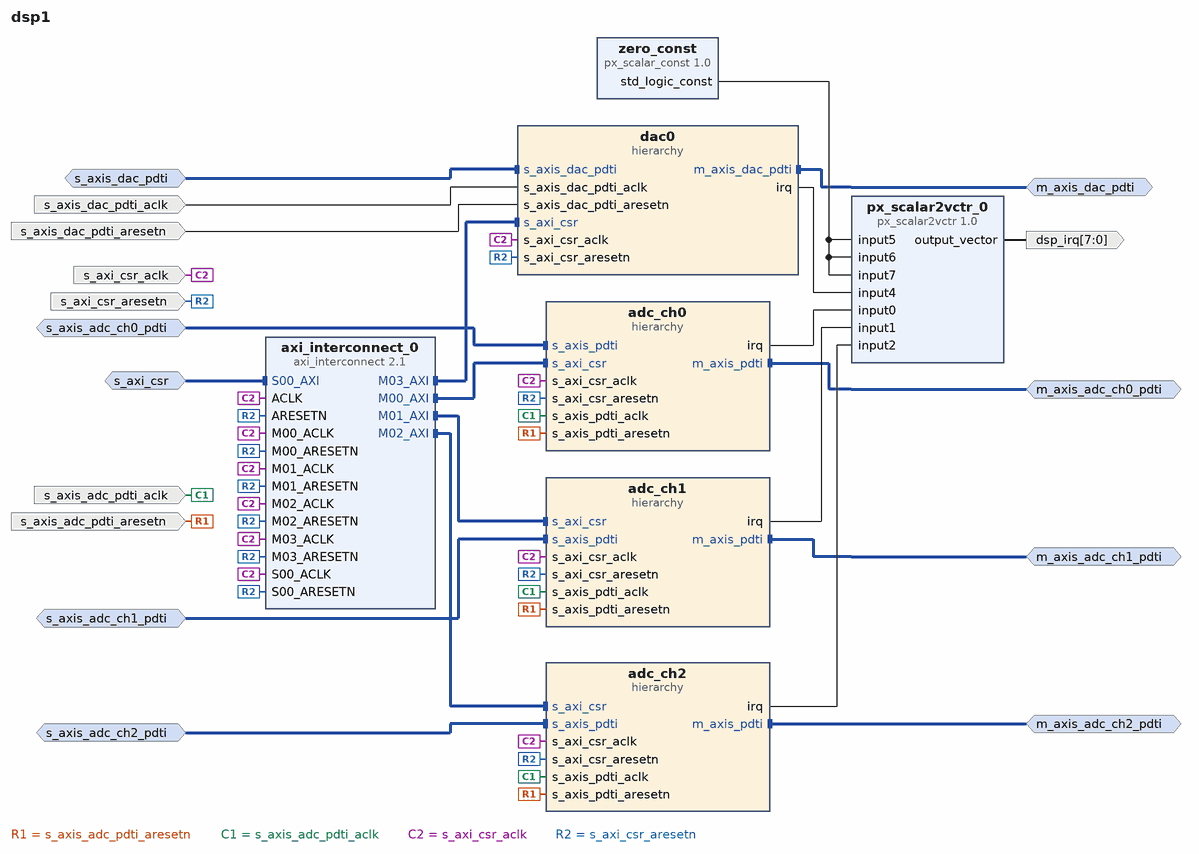
[diagram p0: block diagram of the top level]
# Vivado block design dsp1, xcku060-ffva1156-2-e, Vivado 2017.2
create_bd_design dsp1

create_bd_intf_port -mode Slave -vlnv xilinx.com:interface:aximm_rtl:1.0 s_axi_csr
set_property -dict [list \
  CONFIG.DATA_WIDTH 32 \
  CONFIG.PROTOCOL AXI4LITE \
  CONFIG.FREQ_HZ 250000000 \
  CONFIG.ID_WIDTH 0 \
  CONFIG.ADDR_WIDTH 26 \
  CONFIG.AWUSER_WIDTH 0 \
  CONFIG.ARUSER_WIDTH 0 \
  CONFIG.WUSER_WIDTH 0 \
  CONFIG.RUSER_WIDTH 0 \
  CONFIG.BUSER_WIDTH 0 \
  CONFIG.READ_WRITE_MODE READ_WRITE \
  CONFIG.HAS_BURST 1 \
  CONFIG.HAS_LOCK 1 \
  CONFIG.HAS_PROT 1 \
  CONFIG.HAS_CACHE 1 \
  CONFIG.HAS_QOS 1 \
  CONFIG.HAS_REGION 1 \
  CONFIG.HAS_WSTRB 1 \
  CONFIG.HAS_BRESP 1 \
  CONFIG.HAS_RRESP 1 \
  CONFIG.SUPPORTS_NARROW_BURST 0 \
  CONFIG.NUM_READ_OUTSTANDING 1 \
  CONFIG.NUM_WRITE_OUTSTANDING 1 \
  CONFIG.MAX_BURST_LENGTH 1 \
  CONFIG.CLK_DOMAIN dsp_s_axi_csr_aclk \
  CONFIG.NUM_READ_THREADS 1 \
  CONFIG.NUM_WRITE_THREADS 1 \
  CONFIG.RUSER_BITS_PER_BYTE 0 \
  CONFIG.WUSER_BITS_PER_BYTE 0 \
] [get_bd_intf_ports s_axi_csr]
create_bd_intf_port -mode Slave -vlnv xilinx.com:interface:axis_rtl:1.0 s_axis_adc_ch0_pdti
set_property -dict [list \
  CONFIG.TDATA_NUM_BYTES 2 \
  CONFIG.TDEST_WIDTH 0 \
  CONFIG.TID_WIDTH 0 \
  CONFIG.TUSER_WIDTH 128 \
  CONFIG.HAS_TREADY 0 \
  CONFIG.HAS_TSTRB 0 \
  CONFIG.HAS_TKEEP 0 \
  CONFIG.HAS_TLAST 0 \
  CONFIG.CLK_DOMAIN dsp_s_axis_pdti_aclk \
  CONFIG.LAYERED_METADATA undef \
] [get_bd_intf_ports s_axis_adc_ch0_pdti]
create_bd_intf_port -mode Master -vlnv xilinx.com:interface:axis_rtl:1.0 m_axis_adc_ch0_pdti
set_property -dict {CONFIG.FREQ_HZ 200000000 CONFIG.CLK_DOMAIN dsp_s_axis_pdti_aclk} [get_bd_intf_ports m_axis_adc_ch0_pdti]
create_bd_intf_port -mode Master -vlnv xilinx.com:interface:axis_rtl:1.0 m_axis_adc_ch1_pdti
set_property -dict {CONFIG.FREQ_HZ 200000000 CONFIG.CLK_DOMAIN dsp_s_axis_pdti_aclk} [get_bd_intf_ports m_axis_adc_ch1_pdti]
create_bd_intf_port -mode Slave -vlnv xilinx.com:interface:axis_rtl:1.0 s_axis_adc_ch1_pdti
set_property -dict [list \
  CONFIG.TDATA_NUM_BYTES 2 \
  CONFIG.TDEST_WIDTH 0 \
  CONFIG.TID_WIDTH 0 \
  CONFIG.TUSER_WIDTH 128 \
  CONFIG.HAS_TREADY 0 \
  CONFIG.HAS_TSTRB 0 \
  CONFIG.HAS_TKEEP 0 \
  CONFIG.HAS_TLAST 0 \
  CONFIG.CLK_DOMAIN dsp_s_axis_pdti_aclk \
  CONFIG.LAYERED_METADATA undef \
] [get_bd_intf_ports s_axis_adc_ch1_pdti]
create_bd_intf_port -mode Slave -vlnv xilinx.com:interface:axis_rtl:1.0 s_axis_adc_ch2_pdti
set_property -dict [list \
  CONFIG.TDATA_NUM_BYTES 2 \
  CONFIG.TDEST_WIDTH 0 \
  CONFIG.TID_WIDTH 0 \
  CONFIG.TUSER_WIDTH 128 \
  CONFIG.HAS_TREADY 0 \
  CONFIG.HAS_TSTRB 0 \
  CONFIG.HAS_TKEEP 0 \
  CONFIG.HAS_TLAST 0 \
  CONFIG.LAYERED_METADATA undef \
] [get_bd_intf_ports s_axis_adc_ch2_pdti]
create_bd_intf_port -mode Slave -vlnv xilinx.com:interface:axis_rtl:1.0 s_axis_dac_pdti
set_property -dict [list \
  CONFIG.TDATA_NUM_BYTES 4 \
  CONFIG.TDEST_WIDTH 0 \
  CONFIG.TID_WIDTH 0 \
  CONFIG.TUSER_WIDTH 128 \
  CONFIG.HAS_TREADY 0 \
  CONFIG.HAS_TSTRB 0 \
  CONFIG.HAS_TKEEP 0 \
  CONFIG.HAS_TLAST 0 \
  CONFIG.LAYERED_METADATA undef \
] [get_bd_intf_ports s_axis_dac_pdti]
create_bd_intf_port -mode Master -vlnv xilinx.com:interface:axis_rtl:1.0 m_axis_adc_ch2_pdti
set_property -dict {CONFIG.FREQ_HZ 200000000 CONFIG.CLK_DOMAIN dsp_s_axis_pdti_aclk} [get_bd_intf_ports m_axis_adc_ch2_pdti]
create_bd_intf_port -mode Master -vlnv xilinx.com:interface:axis_rtl:1.0 m_axis_dac_pdti
set_property -dict {CONFIG.FREQ_HZ 250000000 CONFIG.CLK_DOMAIN dsp_s_axis_pdti_aclk} [get_bd_intf_ports m_axis_dac_pdti]
create_bd_port -dir I -type rst s_axis_adc_pdti_aresetn
create_bd_port -dir I -type clk s_axis_adc_pdti_aclk
set_property -dict [list \
  CONFIG.FREQ_HZ 200000000 \
  CONFIG.CLK_DOMAIN dsp_s_axis_pdti_aclk \
  CONFIG.ASSOCIATED_BUSIF s_axis_adc_ch0_pdti:m_axis_adc_ch0_pdti:m_axis_adc_ch1_pdti:s_axis_adc_ch1_pdti:m_axis_adc_ch2_pdti:s_axis_adc_ch2_pdti \
  CONFIG.ASSOCIATED_RESET s_axis_adc_pdti_aresetn \
] [get_bd_ports s_axis_adc_pdti_aclk]
create_bd_port -dir I -type clk s_axi_csr_aclk
set_property -dict [list \
  CONFIG.FREQ_HZ 250000000 \
  CONFIG.CLK_DOMAIN dsp_s_axi_csr_aclk \
  CONFIG.ASSOCIATED_BUSIF s_axi_csr \
  CONFIG.ASSOCIATED_RESET s_axi_csr_aresetn \
] [get_bd_ports s_axi_csr_aclk]
create_bd_port -dir I -type rst s_axi_csr_aresetn
create_bd_port -dir O -from 7 -to 0 dsp_irq
create_bd_port -dir I -type clk s_axis_dac_pdti_aclk
set_property -dict [list \
  CONFIG.FREQ_HZ 250000000 \
  CONFIG.CLK_DOMAIN dsp_s_axis_pdti_aclk \
  CONFIG.ASSOCIATED_BUSIF s_axis_dac_pdti:m_axis_dac_pdti \
  CONFIG.ASSOCIATED_RESET s_axis_dac_pdti_aresetn \
] [get_bd_ports s_axis_dac_pdti_aclk]
create_bd_port -dir I -type rst s_axis_dac_pdti_aresetn

create_bd_cell -type hier adc_ch0
create_bd_cell -type hier adc_ch1
create_bd_cell -type hier adc_ch2
create_bd_cell -type hier dac0
create_bd_cell -type ip -vlnv xilinx.com:ip:axi_interconnect:2.1 axi_interconnect_0
set_property -dict [list \
  CONFIG.NUM_MI 4 \
  CONFIG.M00_HAS_REGSLICE 3 \
  CONFIG.M01_HAS_REGSLICE 3 \
  CONFIG.M02_HAS_REGSLICE 3 \
  CONFIG.M03_HAS_REGSLICE 3 \
  CONFIG.S00_HAS_REGSLICE 1 \
] [get_bd_cells axi_interconnect_0]
create_bd_cell -type ip -vlnv pentek.com:px_ip:px_scalar2vctr:1.0 px_scalar2vctr_0
set_property -dict {CONFIG.number_inputs 8} [get_bd_cells px_scalar2vctr_0]
create_bd_cell -type ip -vlnv pentek.com:px_ip:px_scalar_const:1.0 zero_const

# ---- hierarchy /adc_ch0 ----
current_bd_instance /adc_ch0
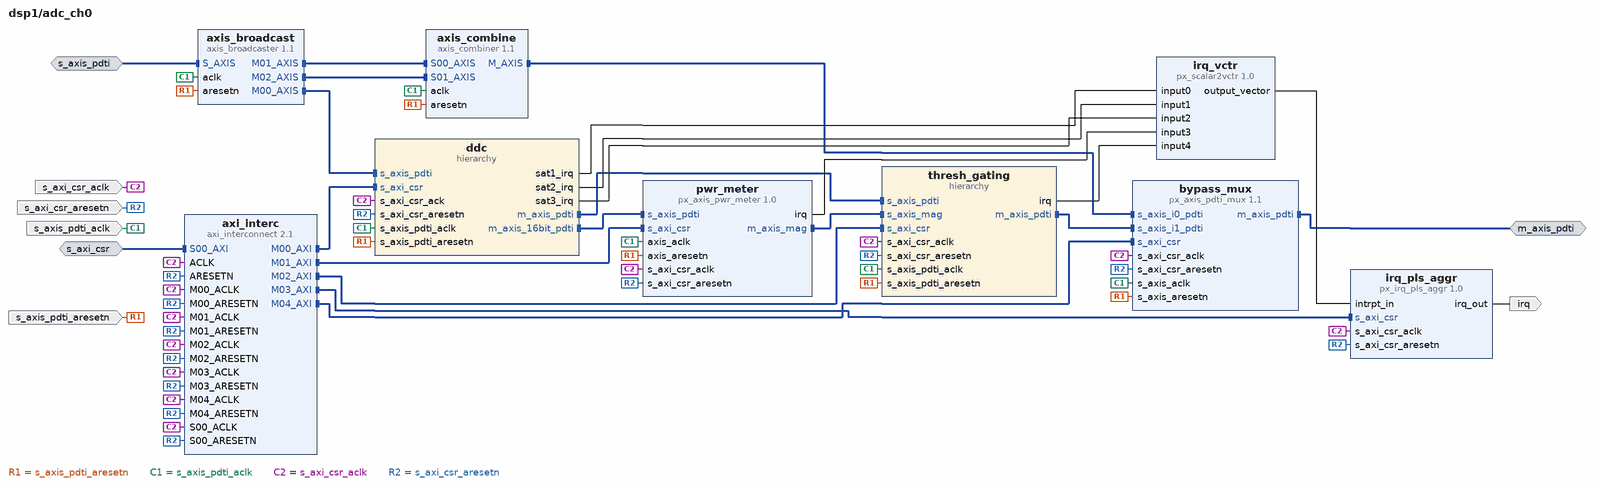
[diagram p1: block diagram inside /adc_ch0]
create_bd_intf_pin -mode Slave -vlnv xilinx.com:interface:aximm_rtl:1.0 s_axi_csr
create_bd_intf_pin -mode Master -vlnv xilinx.com:interface:axis_rtl:1.0 m_axis_pdti
create_bd_intf_pin -mode Slave -vlnv xilinx.com:interface:axis_rtl:1.0 s_axis_pdti
create_bd_pin -dir I s_axis_pdti_aresetn
create_bd_pin -dir I s_axis_pdti_aclk
create_bd_pin -dir I s_axi_csr_aclk
create_bd_pin -dir I s_axi_csr_aresetn
create_bd_pin -dir O irq

create_bd_cell -type hier ddc
create_bd_cell -type hier thresh_gating
create_bd_cell -type ip -vlnv xilinx.com:ip:axi_interconnect:2.1 axi_interc
set_property -dict [list \
  CONFIG.NUM_MI 5 \
  CONFIG.M00_HAS_REGSLICE 3 \
  CONFIG.M01_HAS_REGSLICE 3 \
  CONFIG.M02_HAS_REGSLICE 3 \
  CONFIG.M03_HAS_REGSLICE 3 \
  CONFIG.M04_HAS_REGSLICE 3 \
  CONFIG.S00_HAS_REGSLICE 1 \
] [get_bd_cells axi_interc]
create_bd_cell -type ip -vlnv xilinx.com:ip:axis_broadcaster:1.1 axis_broadcast
set_property -dict [list \
  CONFIG.NUM_MI 3 \
  CONFIG.HAS_TREADY 0 \
  CONFIG.M00_TDATA_REMAP {tdata[15:0]} \
  CONFIG.M01_TDATA_REMAP {tdata[15:0]} \
  CONFIG.M02_TDATA_REMAP {tdata[15:0]} \
  CONFIG.M00_TUSER_REMAP {tuser[127:0]} \
  CONFIG.M01_TUSER_REMAP {tuser[127:0]} \
  CONFIG.M02_TUSER_REMAP {tuser[127:0]} \
] [get_bd_cells axis_broadcast]
create_bd_cell -type ip -vlnv xilinx.com:ip:axis_combiner:1.1 axis_combine
set_property -dict {CONFIG.TDATA_NUM_BYTES 2} [get_bd_cells axis_combine]
create_bd_cell -type ip -vlnv pentek.com:px_ip:px_irq_pls_aggr:1.0 irq_pls_aggr
set_property -dict {CONFIG.num_interrupt_sources 5} [get_bd_cells irq_pls_aggr]
create_bd_cell -type ip -vlnv pentek.com:px_ip:px_scalar2vctr:1.0 irq_vctr
set_property -dict {CONFIG.number_inputs 5} [get_bd_cells irq_vctr]
create_bd_cell -type ip -vlnv pentek.com:px_ip:px_axis_pwr_meter:1.0 pwr_meter
set_property -dict {CONFIG.has_axis_pwr_out false} [get_bd_cells pwr_meter]
create_bd_cell -type ip -vlnv pentek.com:px_ip:px_axis_pdti_mux:1.1 bypass_mux
set_property -dict {CONFIG.data_byte_width 4 CONFIG.add_input_regs false} [get_bd_cells bypass_mux]

# ---- hierarchy /adc_ch0/ddc ----
current_bd_instance /adc_ch0/ddc
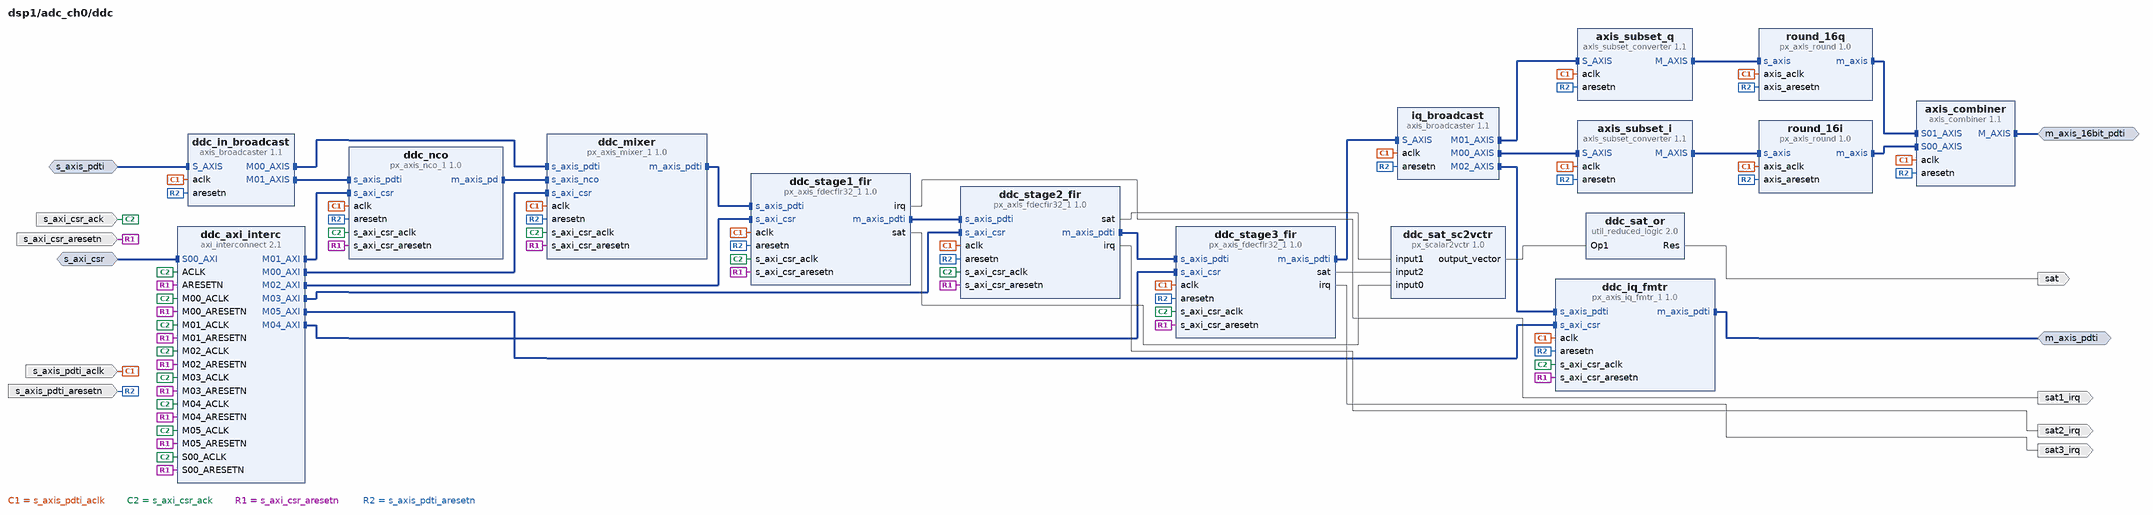
[diagram p2: block diagram inside /adc_ch0/ddc]
create_bd_intf_pin -mode Slave -vlnv xilinx.com:interface:axis_rtl:1.0 s_axis_pdti
create_bd_intf_pin -mode Master -vlnv xilinx.com:interface:axis_rtl:1.0 m_axis_pdti
create_bd_intf_pin -mode Slave -vlnv xilinx.com:interface:aximm_rtl:1.0 s_axi_csr
create_bd_intf_pin -mode Master -vlnv xilinx.com:interface:axis_rtl:1.0 m_axis_16bit_pdti
create_bd_pin -dir I s_axis_pdti_aclk
create_bd_pin -dir I s_axi_csr_ack
create_bd_pin -dir I s_axi_csr_aresetn
create_bd_pin -dir I s_axis_pdti_aresetn
create_bd_pin -dir O sat1_irq
create_bd_pin -dir O sat
create_bd_pin -dir O sat2_irq
create_bd_pin -dir O sat3_irq

create_bd_cell -type ip -vlnv xilinx.com:ip:util_reduced_logic:2.0 ddc_sat_or
set_property -dict {CONFIG.C_SIZE 3 CONFIG.C_OPERATION or} [get_bd_cells ddc_sat_or]
create_bd_cell -type ip -vlnv xilinx.com:ip:axis_combiner:1.1 axis_combiner
set_property -dict {CONFIG.TDATA_NUM_BYTES 2 CONFIG.TUSER_WIDTH 64} [get_bd_cells axis_combiner]
create_bd_cell -type ip -vlnv xilinx.com:ip:axis_subset_converter:1.1 axis_subset_i
set_property -dict [list \
  CONFIG.S_TDATA_NUM_BYTES 6 \
  CONFIG.M_TDATA_NUM_BYTES 3 \
  CONFIG.S_TUSER_WIDTH 128 \
  CONFIG.M_TUSER_WIDTH 64 \
  CONFIG.S_HAS_TREADY 0 \
  CONFIG.M_HAS_TREADY 0 \
  CONFIG.TDATA_REMAP {tdata[23:0]} \
  CONFIG.TUSER_REMAP {tuser[63:0]} \
] [get_bd_cells axis_subset_i]
create_bd_cell -type ip -vlnv xilinx.com:ip:axis_subset_converter:1.1 axis_subset_q
set_property -dict [list \
  CONFIG.S_TDATA_NUM_BYTES 6 \
  CONFIG.M_TDATA_NUM_BYTES 3 \
  CONFIG.S_TUSER_WIDTH 128 \
  CONFIG.M_TUSER_WIDTH 64 \
  CONFIG.S_HAS_TREADY 0 \
  CONFIG.M_HAS_TREADY 0 \
  CONFIG.TDATA_REMAP {tdata[47:24]} \
  CONFIG.TUSER_REMAP {tuser[127:64]} \
] [get_bd_cells axis_subset_q]
create_bd_cell -type ip -vlnv xilinx.com:ip:axi_interconnect:2.1 ddc_axi_interc
set_property -dict [list \
  CONFIG.NUM_MI 6 \
  CONFIG.M00_HAS_REGSLICE 3 \
  CONFIG.M01_HAS_REGSLICE 3 \
  CONFIG.M02_HAS_REGSLICE 3 \
  CONFIG.M03_HAS_REGSLICE 3 \
  CONFIG.M04_HAS_REGSLICE 3 \
  CONFIG.M05_HAS_REGSLICE 3 \
  CONFIG.S00_HAS_REGSLICE 1 \
] [get_bd_cells ddc_axi_interc]
create_bd_cell -type ip -vlnv xilinx.com:ip:axis_broadcaster:1.1 ddc_in_broadcast
set_property -dict [list \
  CONFIG.M_TDATA_NUM_BYTES 2 \
  CONFIG.S_TDATA_NUM_BYTES 2 \
  CONFIG.M_TUSER_WIDTH 128 \
  CONFIG.S_TUSER_WIDTH 128 \
  CONFIG.HAS_TREADY 0 \
  CONFIG.M00_TDATA_REMAP {tdata[15:0]} \
  CONFIG.M01_TDATA_REMAP {tdata[15:0]} \
  CONFIG.M00_TUSER_REMAP {tuser[127:0]} \
  CONFIG.M01_TUSER_REMAP {tuser[127:0]} \
] [get_bd_cells ddc_in_broadcast]
create_bd_cell -type ip -vlnv pentek.com:px_ip:px_scalar2vctr:1.0 ddc_sat_sc2vctr
set_property -dict {CONFIG.number_inputs 3} [get_bd_cells ddc_sat_sc2vctr]
create_bd_cell -type ip -vlnv pentek.com:px_ip:px_axis_fdecfir32_1:1.0 ddc_stage2_fir
create_bd_cell -type ip -vlnv pentek.com:px_ip:px_axis_fdecfir32_1:1.0 ddc_stage3_fir
set_property -dict {CONFIG.out_res 24 CONFIG.bypass_in_lower false} [get_bd_cells ddc_stage3_fir]
create_bd_cell -type ip -vlnv xilinx.com:ip:axis_broadcaster:1.1 iq_broadcast
set_property -dict [list \
  CONFIG.NUM_MI 3 \
  CONFIG.M00_TDATA_REMAP {tdata[47:0]} \
  CONFIG.M01_TDATA_REMAP {tdata[47:0]} \
  CONFIG.M02_TDATA_REMAP {tdata[47:0]} \
  CONFIG.M00_TUSER_REMAP {tuser[127:0]} \
  CONFIG.M01_TUSER_REMAP {tuser[127:0]} \
  CONFIG.M02_TUSER_REMAP {tuser[127:0]} \
] [get_bd_cells iq_broadcast]
create_bd_cell -type ip -vlnv pentek.com:px_ip:px_axis_fdecfir32_1:1.0 ddc_stage1_fir
create_bd_cell -type ip -vlnv pentek.com:px_ip:px_axis_round:1.0 round_16i
set_property -dict {CONFIG.has_tuser true CONFIG.tuser_width 64} [get_bd_cells round_16i]
create_bd_cell -type ip -vlnv pentek.com:px_ip:px_axis_round:1.0 round_16q
set_property -dict {CONFIG.has_tuser true CONFIG.tuser_width 64} [get_bd_cells round_16q]
create_bd_cell -type ip -vlnv pentek.com:px_ip:px_axis_iq_fmtr_1:1.0 ddc_iq_fmtr
create_bd_cell -type ip -vlnv pentek.com:px_ip:px_axis_mixer_1:1.0 ddc_mixer
set_property -dict {CONFIG.sub_chan false CONFIG.chan 4} [get_bd_cells ddc_mixer]
create_bd_cell -type ip -vlnv pentek.com:px_ip:px_axis_nco_1:1.0 ddc_nco

# ---- hierarchy /adc_ch0/thresh_gating ----
current_bd_instance /adc_ch0/thresh_gating
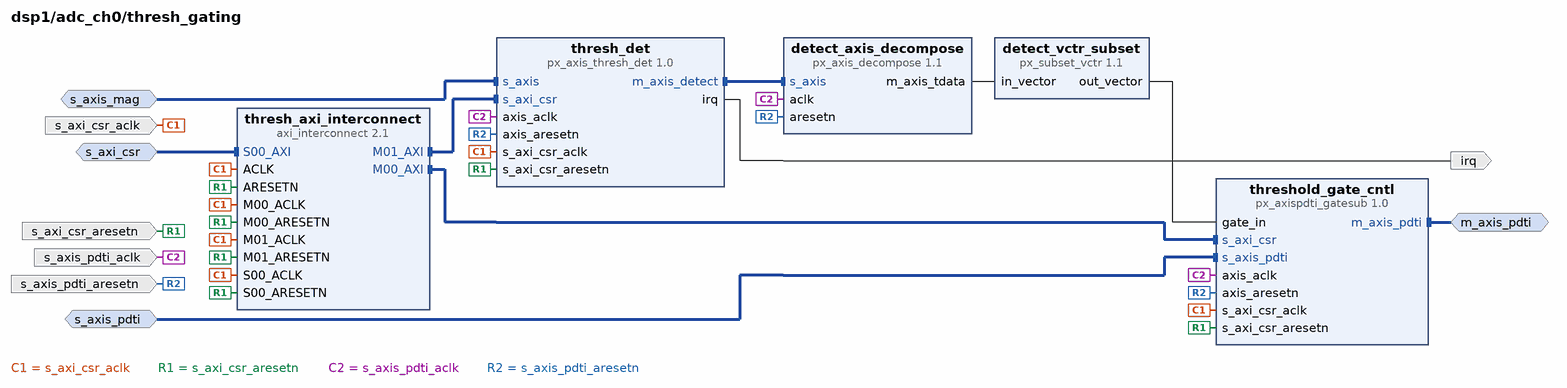
[diagram p3: block diagram inside /adc_ch0/thresh_gating]
create_bd_intf_pin -mode Slave -vlnv xilinx.com:interface:aximm_rtl:1.0 s_axi_csr
create_bd_intf_pin -mode Slave -vlnv xilinx.com:interface:axis_rtl:1.0 s_axis_mag
create_bd_intf_pin -mode Slave -vlnv xilinx.com:interface:axis_rtl:1.0 s_axis_pdti
create_bd_intf_pin -mode Master -vlnv xilinx.com:interface:axis_rtl:1.0 m_axis_pdti
create_bd_pin -dir I s_axi_csr_aclk
create_bd_pin -dir I s_axi_csr_aresetn
create_bd_pin -dir I s_axis_pdti_aclk
create_bd_pin -dir I s_axis_pdti_aresetn
create_bd_pin -dir O irq

create_bd_cell -type ip -vlnv pentek.com:px_ip:px_axis_decompose:1.1 detect_axis_decompose
set_property -dict {CONFIG.tdata_width 8} [get_bd_cells detect_axis_decompose]
create_bd_cell -type ip -vlnv pentek.com:px_ip:px_axispdti_gatesub:1.0 threshold_gate_cntl
set_property -dict {CONFIG.num_bytes 4} [get_bd_cells threshold_gate_cntl]
create_bd_cell -type ip -vlnv pentek.com:px_ip:px_subset_vctr:1.1 detect_vctr_subset
set_property -dict {CONFIG.in_vector_length 8 CONFIG.out_start_index 0 CONFIG.out_end_index 0} [get_bd_cells detect_vctr_subset]
create_bd_cell -type ip -vlnv xilinx.com:ip:axi_interconnect:2.1 thresh_axi_interconnect
set_property -dict [list \
  CONFIG.M00_HAS_REGSLICE 3 \
  CONFIG.M01_HAS_REGSLICE 3 \
  CONFIG.S00_HAS_REGSLICE 1 \
] [get_bd_cells thresh_axi_interconnect]
create_bd_cell -type ip -vlnv pentek.com:px_ip:px_axis_thresh_det:1.0 thresh_det
set_property -dict {CONFIG.data_width 16 CONFIG.default_thresh 255} [get_bd_cells thresh_det]

# ---- hierarchy /adc_ch1 ----
current_bd_instance /adc_ch1
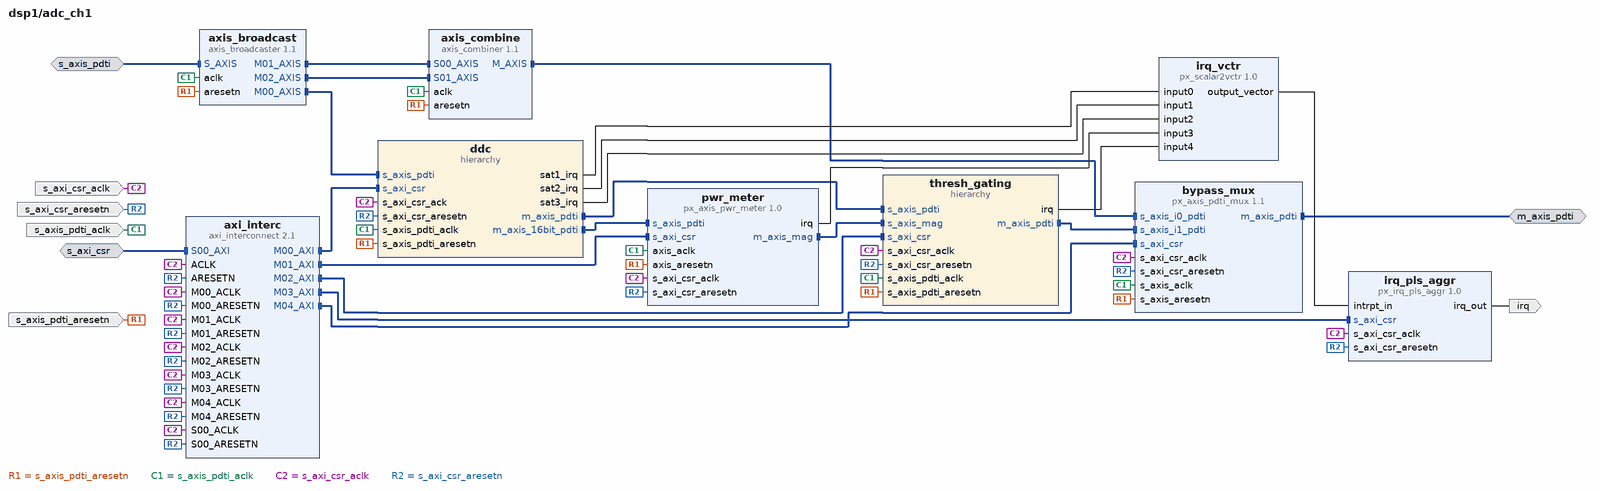
[diagram p4: block diagram inside /adc_ch1]
create_bd_intf_pin -mode Slave -vlnv xilinx.com:interface:aximm_rtl:1.0 s_axi_csr
create_bd_intf_pin -mode Master -vlnv xilinx.com:interface:axis_rtl:1.0 m_axis_pdti
create_bd_intf_pin -mode Slave -vlnv xilinx.com:interface:axis_rtl:1.0 s_axis_pdti
create_bd_pin -dir I s_axis_pdti_aresetn
create_bd_pin -dir I s_axis_pdti_aclk
create_bd_pin -dir I s_axi_csr_aclk
create_bd_pin -dir I s_axi_csr_aresetn
create_bd_pin -dir O irq

create_bd_cell -type hier thresh_gating
create_bd_cell -type hier ddc
create_bd_cell -type ip -vlnv xilinx.com:ip:axi_interconnect:2.1 axi_interc
set_property -dict [list \
  CONFIG.NUM_MI 5 \
  CONFIG.M00_HAS_REGSLICE 3 \
  CONFIG.M01_HAS_REGSLICE 3 \
  CONFIG.M02_HAS_REGSLICE 3 \
  CONFIG.M03_HAS_REGSLICE 3 \
  CONFIG.M04_HAS_REGSLICE 3 \
  CONFIG.S00_HAS_REGSLICE 1 \
] [get_bd_cells axi_interc]
create_bd_cell -type ip -vlnv xilinx.com:ip:axis_broadcaster:1.1 axis_broadcast
set_property -dict [list \
  CONFIG.NUM_MI 3 \
  CONFIG.HAS_TREADY 0 \
  CONFIG.M00_TDATA_REMAP {tdata[15:0]} \
  CONFIG.M01_TDATA_REMAP {tdata[15:0]} \
  CONFIG.M02_TDATA_REMAP {tdata[15:0]} \
  CONFIG.M00_TUSER_REMAP {tuser[127:0]} \
  CONFIG.M01_TUSER_REMAP {tuser[127:0]} \
  CONFIG.M02_TUSER_REMAP {tuser[127:0]} \
] [get_bd_cells axis_broadcast]
create_bd_cell -type ip -vlnv xilinx.com:ip:axis_combiner:1.1 axis_combine
set_property -dict {CONFIG.TDATA_NUM_BYTES 2} [get_bd_cells axis_combine]
create_bd_cell -type ip -vlnv pentek.com:px_ip:px_axis_pdti_mux:1.1 bypass_mux
set_property -dict {CONFIG.data_byte_width 4 CONFIG.add_input_regs false} [get_bd_cells bypass_mux]
create_bd_cell -type ip -vlnv pentek.com:px_ip:px_irq_pls_aggr:1.0 irq_pls_aggr
set_property -dict {CONFIG.num_interrupt_sources 5} [get_bd_cells irq_pls_aggr]
create_bd_cell -type ip -vlnv pentek.com:px_ip:px_scalar2vctr:1.0 irq_vctr
set_property -dict {CONFIG.number_inputs 5} [get_bd_cells irq_vctr]
create_bd_cell -type ip -vlnv pentek.com:px_ip:px_axis_pwr_meter:1.0 pwr_meter
set_property -dict {CONFIG.has_axis_pwr_out false} [get_bd_cells pwr_meter]

# ---- hierarchy /adc_ch1/thresh_gating ----
current_bd_instance /adc_ch1/thresh_gating
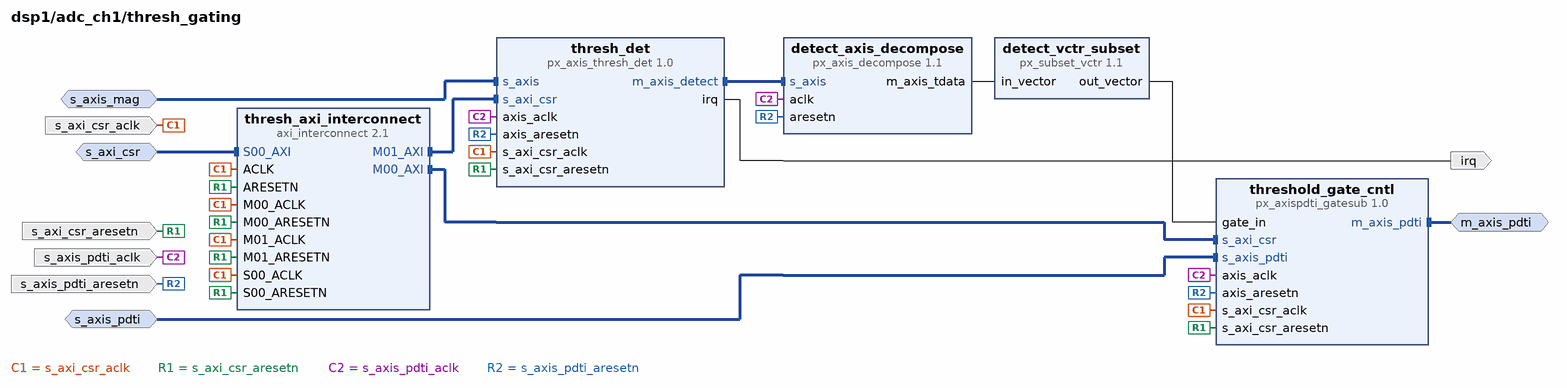
[diagram p5: block diagram inside /adc_ch1/thresh_gating]
create_bd_intf_pin -mode Slave -vlnv xilinx.com:interface:aximm_rtl:1.0 s_axi_csr
create_bd_intf_pin -mode Slave -vlnv xilinx.com:interface:axis_rtl:1.0 s_axis_mag
create_bd_intf_pin -mode Slave -vlnv xilinx.com:interface:axis_rtl:1.0 s_axis_pdti
create_bd_intf_pin -mode Master -vlnv xilinx.com:interface:axis_rtl:1.0 m_axis_pdti
create_bd_pin -dir I s_axi_csr_aclk
create_bd_pin -dir I s_axi_csr_aresetn
create_bd_pin -dir I s_axis_pdti_aclk
create_bd_pin -dir I s_axis_pdti_aresetn
create_bd_pin -dir O irq

create_bd_cell -type ip -vlnv pentek.com:px_ip:px_axis_decompose:1.1 detect_axis_decompose
set_property -dict {CONFIG.tdata_width 8} [get_bd_cells detect_axis_decompose]
create_bd_cell -type ip -vlnv pentek.com:px_ip:px_subset_vctr:1.1 detect_vctr_subset
set_property -dict {CONFIG.in_vector_length 8 CONFIG.out_start_index 0 CONFIG.out_end_index 0} [get_bd_cells detect_vctr_subset]
create_bd_cell -type ip -vlnv xilinx.com:ip:axi_interconnect:2.1 thresh_axi_interconnect
set_property -dict [list \
  CONFIG.M00_HAS_REGSLICE 3 \
  CONFIG.M01_HAS_REGSLICE 3 \
  CONFIG.S00_HAS_REGSLICE 1 \
] [get_bd_cells thresh_axi_interconnect]
create_bd_cell -type ip -vlnv pentek.com:px_ip:px_axispdti_gatesub:1.0 threshold_gate_cntl
set_property -dict {CONFIG.num_bytes 4} [get_bd_cells threshold_gate_cntl]
create_bd_cell -type ip -vlnv pentek.com:px_ip:px_axis_thresh_det:1.0 thresh_det
set_property -dict {CONFIG.data_width 16 CONFIG.default_thresh 255} [get_bd_cells thresh_det]

# ---- hierarchy /adc_ch1/ddc ----
current_bd_instance /adc_ch1/ddc
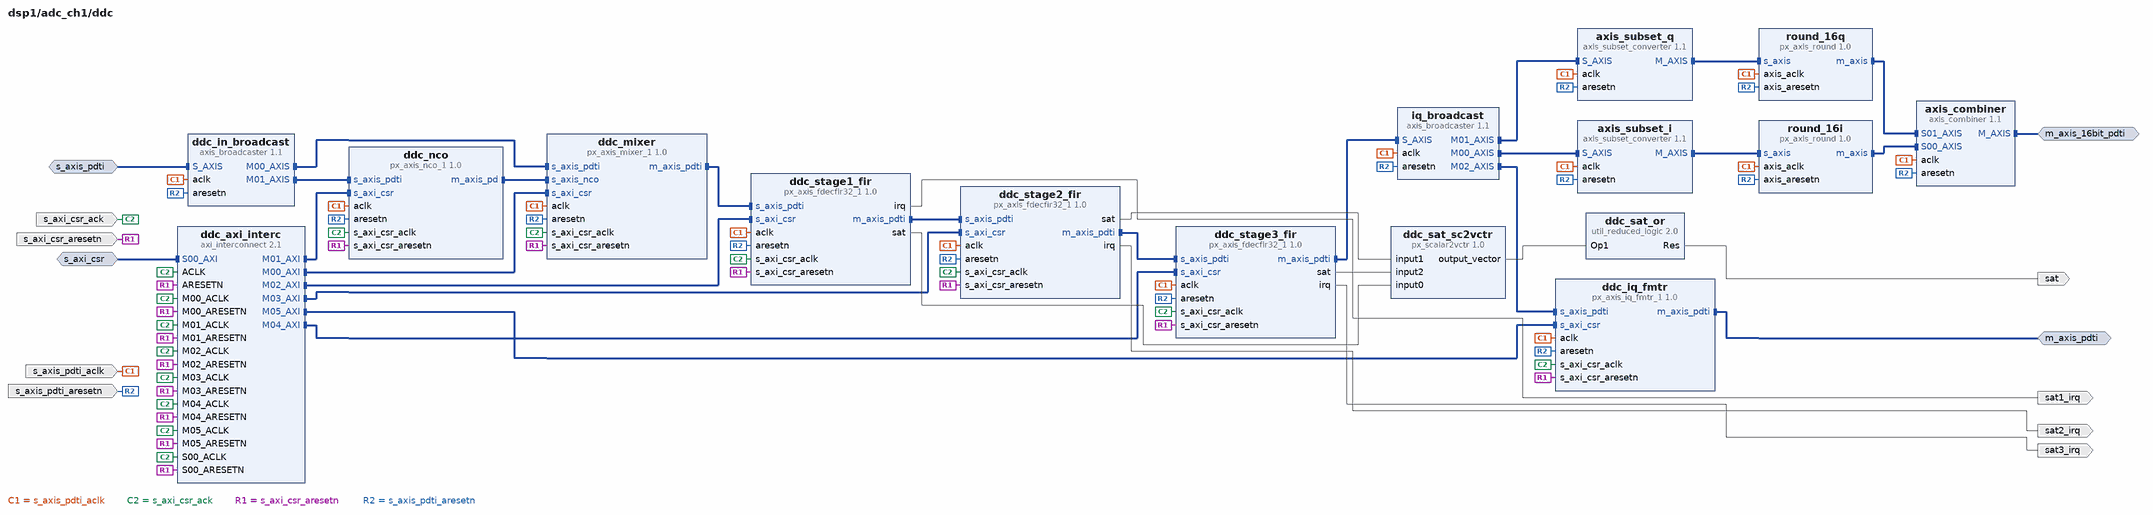
[diagram p6: block diagram inside /adc_ch1/ddc]
create_bd_intf_pin -mode Slave -vlnv xilinx.com:interface:axis_rtl:1.0 s_axis_pdti
create_bd_intf_pin -mode Master -vlnv xilinx.com:interface:axis_rtl:1.0 m_axis_pdti
create_bd_intf_pin -mode Slave -vlnv xilinx.com:interface:aximm_rtl:1.0 s_axi_csr
create_bd_intf_pin -mode Master -vlnv xilinx.com:interface:axis_rtl:1.0 m_axis_16bit_pdti
create_bd_pin -dir I s_axis_pdti_aclk
create_bd_pin -dir I s_axi_csr_ack
create_bd_pin -dir I s_axi_csr_aresetn
create_bd_pin -dir I s_axis_pdti_aresetn
create_bd_pin -dir O sat1_irq
create_bd_pin -dir O sat
create_bd_pin -dir O sat2_irq
create_bd_pin -dir O sat3_irq

create_bd_cell -type ip -vlnv xilinx.com:ip:util_reduced_logic:2.0 ddc_sat_or
set_property -dict {CONFIG.C_SIZE 3 CONFIG.C_OPERATION or} [get_bd_cells ddc_sat_or]
create_bd_cell -type ip -vlnv xilinx.com:ip:axis_combiner:1.1 axis_combiner
set_property -dict {CONFIG.TDATA_NUM_BYTES 2 CONFIG.TUSER_WIDTH 64} [get_bd_cells axis_combiner]
create_bd_cell -type ip -vlnv xilinx.com:ip:axis_subset_converter:1.1 axis_subset_i
set_property -dict [list \
  CONFIG.S_TDATA_NUM_BYTES 6 \
  CONFIG.M_TDATA_NUM_BYTES 3 \
  CONFIG.S_TUSER_WIDTH 128 \
  CONFIG.M_TUSER_WIDTH 64 \
  CONFIG.S_HAS_TREADY 0 \
  CONFIG.M_HAS_TREADY 0 \
  CONFIG.TDATA_REMAP {tdata[23:0]} \
  CONFIG.TUSER_REMAP {tuser[63:0]} \
] [get_bd_cells axis_subset_i]
create_bd_cell -type ip -vlnv xilinx.com:ip:axis_subset_converter:1.1 axis_subset_q
set_property -dict [list \
  CONFIG.S_TDATA_NUM_BYTES 6 \
  CONFIG.M_TDATA_NUM_BYTES 3 \
  CONFIG.S_TUSER_WIDTH 128 \
  CONFIG.M_TUSER_WIDTH 64 \
  CONFIG.S_HAS_TREADY 0 \
  CONFIG.M_HAS_TREADY 0 \
  CONFIG.TDATA_REMAP {tdata[47:24]} \
  CONFIG.TUSER_REMAP {tuser[127:64]} \
] [get_bd_cells axis_subset_q]
create_bd_cell -type ip -vlnv xilinx.com:ip:axi_interconnect:2.1 ddc_axi_interc
set_property -dict [list \
  CONFIG.NUM_MI 6 \
  CONFIG.M00_HAS_REGSLICE 3 \
  CONFIG.M01_HAS_REGSLICE 3 \
  CONFIG.M02_HAS_REGSLICE 3 \
  CONFIG.M03_HAS_REGSLICE 3 \
  CONFIG.M04_HAS_REGSLICE 3 \
  CONFIG.M05_HAS_REGSLICE 3 \
  CONFIG.S00_HAS_REGSLICE 1 \
] [get_bd_cells ddc_axi_interc]
create_bd_cell -type ip -vlnv xilinx.com:ip:axis_broadcaster:1.1 ddc_in_broadcast
set_property -dict [list \
  CONFIG.M_TDATA_NUM_BYTES 2 \
  CONFIG.S_TDATA_NUM_BYTES 2 \
  CONFIG.M_TUSER_WIDTH 128 \
  CONFIG.S_TUSER_WIDTH 128 \
  CONFIG.HAS_TREADY 0 \
  CONFIG.M00_TDATA_REMAP {tdata[15:0]} \
  CONFIG.M01_TDATA_REMAP {tdata[15:0]} \
  CONFIG.M00_TUSER_REMAP {tuser[127:0]} \
  CONFIG.M01_TUSER_REMAP {tuser[127:0]} \
] [get_bd_cells ddc_in_broadcast]
create_bd_cell -type ip -vlnv pentek.com:px_ip:px_scalar2vctr:1.0 ddc_sat_sc2vctr
set_property -dict {CONFIG.number_inputs 3} [get_bd_cells ddc_sat_sc2vctr]
create_bd_cell -type ip -vlnv pentek.com:px_ip:px_axis_fdecfir32_1:1.0 ddc_stage1_fir
create_bd_cell -type ip -vlnv pentek.com:px_ip:px_axis_fdecfir32_1:1.0 ddc_stage2_fir
create_bd_cell -type ip -vlnv pentek.com:px_ip:px_axis_fdecfir32_1:1.0 ddc_stage3_fir
set_property -dict {CONFIG.out_res 24 CONFIG.bypass_in_lower false} [get_bd_cells ddc_stage3_fir]
create_bd_cell -type ip -vlnv xilinx.com:ip:axis_broadcaster:1.1 iq_broadcast
set_property -dict [list \
  CONFIG.NUM_MI 3 \
  CONFIG.M00_TDATA_REMAP {tdata[47:0]} \
  CONFIG.M01_TDATA_REMAP {tdata[47:0]} \
  CONFIG.M02_TDATA_REMAP {tdata[47:0]} \
  CONFIG.M00_TUSER_REMAP {tuser[127:0]} \
  CONFIG.M01_TUSER_REMAP {tuser[127:0]} \
  CONFIG.M02_TUSER_REMAP {tuser[127:0]} \
] [get_bd_cells iq_broadcast]
create_bd_cell -type ip -vlnv pentek.com:px_ip:px_axis_round:1.0 round_16i
set_property -dict {CONFIG.has_tuser true CONFIG.tuser_width 64} [get_bd_cells round_16i]
create_bd_cell -type ip -vlnv pentek.com:px_ip:px_axis_round:1.0 round_16q
set_property -dict {CONFIG.has_tuser true CONFIG.tuser_width 64} [get_bd_cells round_16q]
create_bd_cell -type ip -vlnv pentek.com:px_ip:px_axis_iq_fmtr_1:1.0 ddc_iq_fmtr
create_bd_cell -type ip -vlnv pentek.com:px_ip:px_axis_mixer_1:1.0 ddc_mixer
set_property -dict {CONFIG.sub_chan false CONFIG.chan 4} [get_bd_cells ddc_mixer]
create_bd_cell -type ip -vlnv pentek.com:px_ip:px_axis_nco_1:1.0 ddc_nco

# ---- hierarchy /adc_ch2 ----
current_bd_instance /adc_ch2
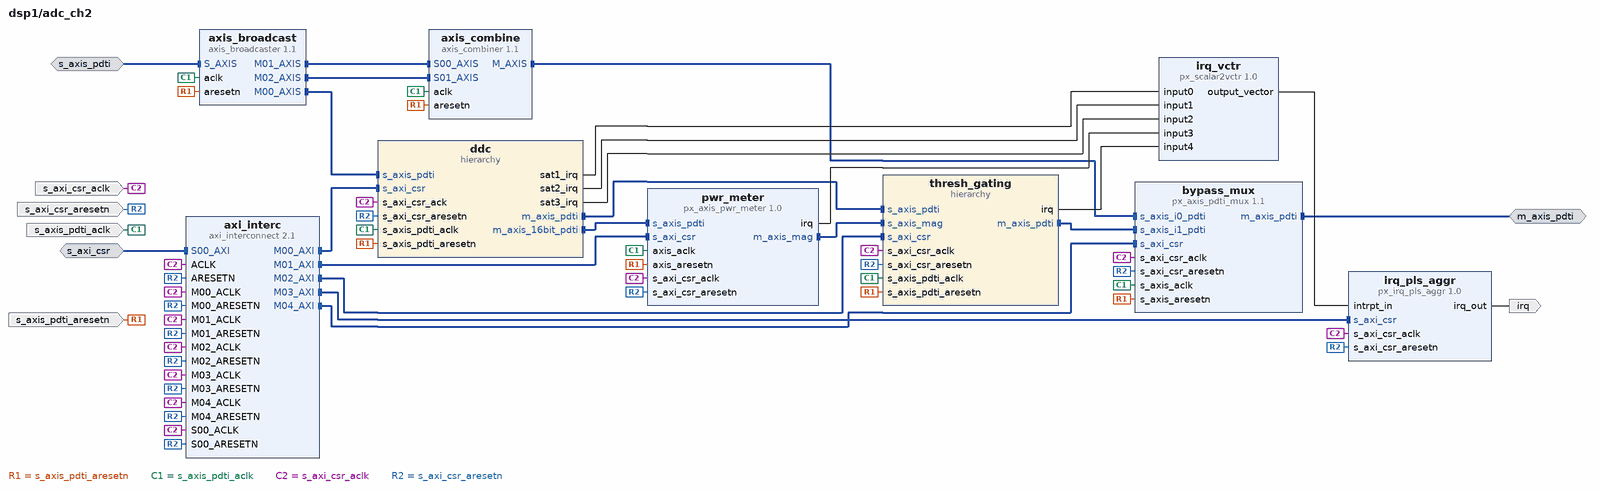
[diagram p7: block diagram inside /adc_ch2]
create_bd_intf_pin -mode Slave -vlnv xilinx.com:interface:aximm_rtl:1.0 s_axi_csr
create_bd_intf_pin -mode Master -vlnv xilinx.com:interface:axis_rtl:1.0 m_axis_pdti
create_bd_intf_pin -mode Slave -vlnv xilinx.com:interface:axis_rtl:1.0 s_axis_pdti
create_bd_pin -dir I s_axis_pdti_aresetn
create_bd_pin -dir I s_axis_pdti_aclk
create_bd_pin -dir I s_axi_csr_aclk
create_bd_pin -dir I s_axi_csr_aresetn
create_bd_pin -dir O irq

create_bd_cell -type hier thresh_gating
create_bd_cell -type hier ddc
create_bd_cell -type ip -vlnv xilinx.com:ip:axi_interconnect:2.1 axi_interc
set_property -dict [list \
  CONFIG.NUM_MI 5 \
  CONFIG.M00_HAS_REGSLICE 3 \
  CONFIG.M01_HAS_REGSLICE 3 \
  CONFIG.M02_HAS_REGSLICE 3 \
  CONFIG.M03_HAS_REGSLICE 3 \
  CONFIG.M04_HAS_REGSLICE 3 \
  CONFIG.S00_HAS_REGSLICE 1 \
] [get_bd_cells axi_interc]
create_bd_cell -type ip -vlnv xilinx.com:ip:axis_broadcaster:1.1 axis_broadcast
set_property -dict [list \
  CONFIG.NUM_MI 3 \
  CONFIG.HAS_TREADY 0 \
  CONFIG.M00_TDATA_REMAP {tdata[15:0]} \
  CONFIG.M01_TDATA_REMAP {tdata[15:0]} \
  CONFIG.M02_TDATA_REMAP {tdata[15:0]} \
  CONFIG.M00_TUSER_REMAP {tuser[127:0]} \
  CONFIG.M01_TUSER_REMAP {tuser[127:0]} \
  CONFIG.M02_TUSER_REMAP {tuser[127:0]} \
] [get_bd_cells axis_broadcast]
create_bd_cell -type ip -vlnv xilinx.com:ip:axis_combiner:1.1 axis_combine
set_property -dict {CONFIG.TDATA_NUM_BYTES 2} [get_bd_cells axis_combine]
create_bd_cell -type ip -vlnv pentek.com:px_ip:px_axis_pdti_mux:1.1 bypass_mux
set_property -dict {CONFIG.data_byte_width 4 CONFIG.add_input_regs false} [get_bd_cells bypass_mux]
create_bd_cell -type ip -vlnv pentek.com:px_ip:px_irq_pls_aggr:1.0 irq_pls_aggr
set_property -dict {CONFIG.num_interrupt_sources 5} [get_bd_cells irq_pls_aggr]
create_bd_cell -type ip -vlnv pentek.com:px_ip:px_scalar2vctr:1.0 irq_vctr
set_property -dict {CONFIG.number_inputs 5} [get_bd_cells irq_vctr]
create_bd_cell -type ip -vlnv pentek.com:px_ip:px_axis_pwr_meter:1.0 pwr_meter
set_property -dict {CONFIG.has_axis_pwr_out false} [get_bd_cells pwr_meter]

# ---- hierarchy /adc_ch2/thresh_gating ----
current_bd_instance /adc_ch2/thresh_gating
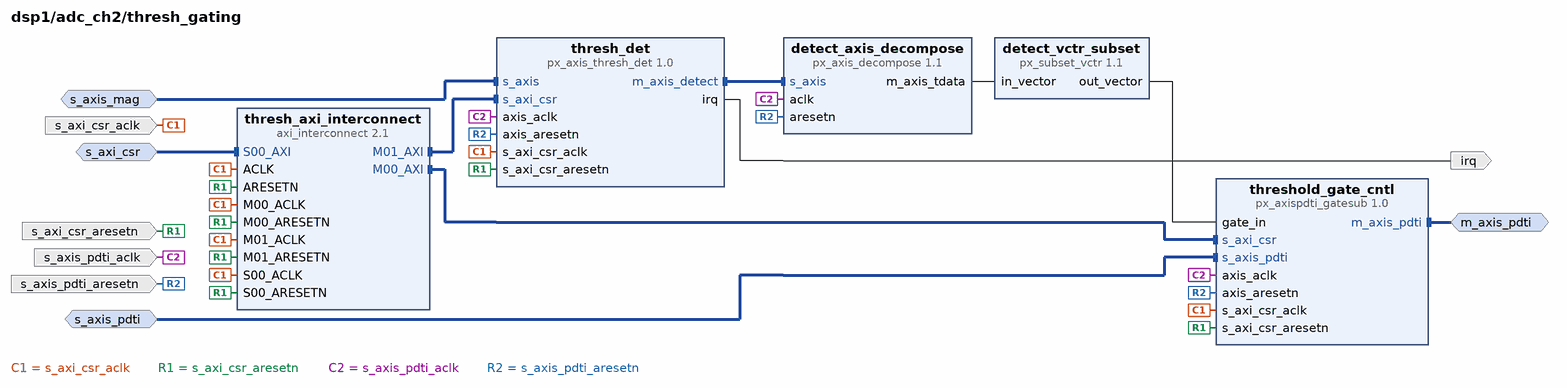
[diagram p8: block diagram inside /adc_ch2/thresh_gating]
create_bd_intf_pin -mode Slave -vlnv xilinx.com:interface:aximm_rtl:1.0 s_axi_csr
create_bd_intf_pin -mode Slave -vlnv xilinx.com:interface:axis_rtl:1.0 s_axis_mag
create_bd_intf_pin -mode Slave -vlnv xilinx.com:interface:axis_rtl:1.0 s_axis_pdti
create_bd_intf_pin -mode Master -vlnv xilinx.com:interface:axis_rtl:1.0 m_axis_pdti
create_bd_pin -dir I s_axi_csr_aclk
create_bd_pin -dir I s_axi_csr_aresetn
create_bd_pin -dir I s_axis_pdti_aclk
create_bd_pin -dir I s_axis_pdti_aresetn
create_bd_pin -dir O irq

create_bd_cell -type ip -vlnv pentek.com:px_ip:px_axis_decompose:1.1 detect_axis_decompose
set_property -dict {CONFIG.tdata_width 8} [get_bd_cells detect_axis_decompose]
create_bd_cell -type ip -vlnv pentek.com:px_ip:px_subset_vctr:1.1 detect_vctr_subset
set_property -dict {CONFIG.in_vector_length 8 CONFIG.out_start_index 0 CONFIG.out_end_index 0} [get_bd_cells detect_vctr_subset]
create_bd_cell -type ip -vlnv xilinx.com:ip:axi_interconnect:2.1 thresh_axi_interconnect
set_property -dict [list \
  CONFIG.M00_HAS_REGSLICE 3 \
  CONFIG.M01_HAS_REGSLICE 3 \
  CONFIG.S00_HAS_REGSLICE 1 \
] [get_bd_cells thresh_axi_interconnect]
create_bd_cell -type ip -vlnv pentek.com:px_ip:px_axispdti_gatesub:1.0 threshold_gate_cntl
set_property -dict {CONFIG.num_bytes 4} [get_bd_cells threshold_gate_cntl]
create_bd_cell -type ip -vlnv pentek.com:px_ip:px_axis_thresh_det:1.0 thresh_det
set_property -dict {CONFIG.data_width 16 CONFIG.default_thresh 255} [get_bd_cells thresh_det]

# ---- hierarchy /adc_ch2/ddc ----
current_bd_instance /adc_ch2/ddc
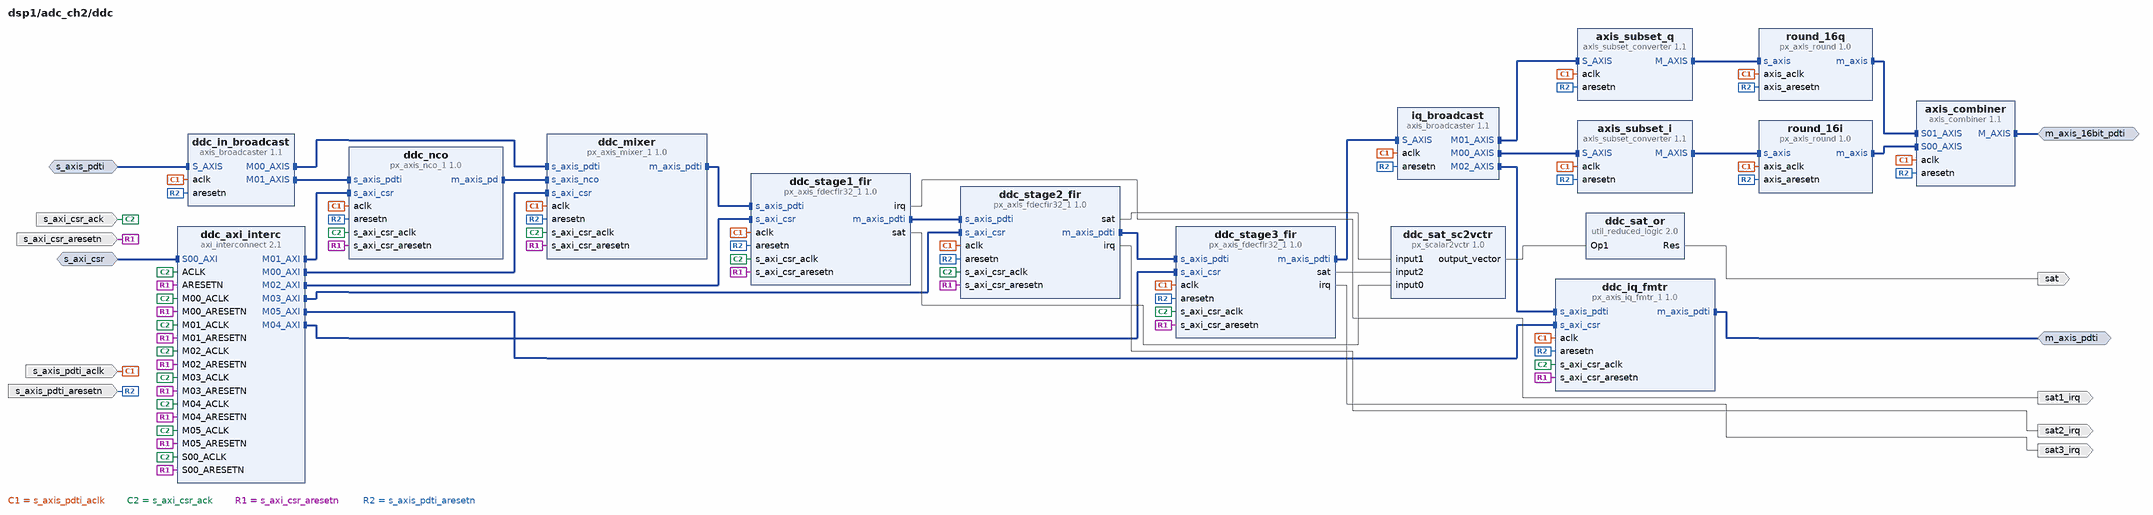
[diagram p9: block diagram inside /adc_ch2/ddc]
create_bd_intf_pin -mode Slave -vlnv xilinx.com:interface:axis_rtl:1.0 s_axis_pdti
create_bd_intf_pin -mode Master -vlnv xilinx.com:interface:axis_rtl:1.0 m_axis_pdti
create_bd_intf_pin -mode Slave -vlnv xilinx.com:interface:aximm_rtl:1.0 s_axi_csr
create_bd_intf_pin -mode Master -vlnv xilinx.com:interface:axis_rtl:1.0 m_axis_16bit_pdti
create_bd_pin -dir I s_axis_pdti_aclk
create_bd_pin -dir I s_axi_csr_ack
create_bd_pin -dir I s_axi_csr_aresetn
create_bd_pin -dir I s_axis_pdti_aresetn
create_bd_pin -dir O sat1_irq
create_bd_pin -dir O sat
create_bd_pin -dir O sat2_irq
create_bd_pin -dir O sat3_irq

create_bd_cell -type ip -vlnv xilinx.com:ip:util_reduced_logic:2.0 ddc_sat_or
set_property -dict {CONFIG.C_SIZE 3 CONFIG.C_OPERATION or} [get_bd_cells ddc_sat_or]
create_bd_cell -type ip -vlnv xilinx.com:ip:axis_combiner:1.1 axis_combiner
set_property -dict {CONFIG.TDATA_NUM_BYTES 2 CONFIG.TUSER_WIDTH 64} [get_bd_cells axis_combiner]
create_bd_cell -type ip -vlnv xilinx.com:ip:axis_subset_converter:1.1 axis_subset_i
set_property -dict [list \
  CONFIG.S_TDATA_NUM_BYTES 6 \
  CONFIG.M_TDATA_NUM_BYTES 3 \
  CONFIG.S_TUSER_WIDTH 128 \
  CONFIG.M_TUSER_WIDTH 64 \
  CONFIG.S_HAS_TREADY 0 \
  CONFIG.M_HAS_TREADY 0 \
  CONFIG.TDATA_REMAP {tdata[23:0]} \
  CONFIG.TUSER_REMAP {tuser[63:0]} \
] [get_bd_cells axis_subset_i]
create_bd_cell -type ip -vlnv xilinx.com:ip:axis_subset_converter:1.1 axis_subset_q
set_property -dict [list \
  CONFIG.S_TDATA_NUM_BYTES 6 \
  CONFIG.M_TDATA_NUM_BYTES 3 \
  CONFIG.S_TUSER_WIDTH 128 \
  CONFIG.M_TUSER_WIDTH 64 \
  CONFIG.S_HAS_TREADY 0 \
  CONFIG.M_HAS_TREADY 0 \
  CONFIG.TDATA_REMAP {tdata[47:24]} \
  CONFIG.TUSER_REMAP {tuser[127:64]} \
] [get_bd_cells axis_subset_q]
create_bd_cell -type ip -vlnv xilinx.com:ip:axi_interconnect:2.1 ddc_axi_interc
set_property -dict [list \
  CONFIG.NUM_MI 6 \
  CONFIG.M00_HAS_REGSLICE 3 \
  CONFIG.M01_HAS_REGSLICE 3 \
  CONFIG.M02_HAS_REGSLICE 3 \
  CONFIG.M03_HAS_REGSLICE 3 \
  CONFIG.M04_HAS_REGSLICE 3 \
  CONFIG.M05_HAS_REGSLICE 3 \
  CONFIG.S00_HAS_REGSLICE 1 \
] [get_bd_cells ddc_axi_interc]
create_bd_cell -type ip -vlnv xilinx.com:ip:axis_broadcaster:1.1 ddc_in_broadcast
set_property -dict [list \
  CONFIG.M_TDATA_NUM_BYTES 2 \
  CONFIG.S_TDATA_NUM_BYTES 2 \
  CONFIG.M_TUSER_WIDTH 128 \
  CONFIG.S_TUSER_WIDTH 128 \
  CONFIG.HAS_TREADY 0 \
  CONFIG.M00_TDATA_REMAP {tdata[15:0]} \
  CONFIG.M01_TDATA_REMAP {tdata[15:0]} \
  CONFIG.M00_TUSER_REMAP {tuser[127:0]} \
  CONFIG.M01_TUSER_REMAP {tuser[127:0]} \
] [get_bd_cells ddc_in_broadcast]
create_bd_cell -type ip -vlnv pentek.com:px_ip:px_scalar2vctr:1.0 ddc_sat_sc2vctr
set_property -dict {CONFIG.number_inputs 3} [get_bd_cells ddc_sat_sc2vctr]
create_bd_cell -type ip -vlnv pentek.com:px_ip:px_axis_fdecfir32_1:1.0 ddc_stage1_fir
create_bd_cell -type ip -vlnv pentek.com:px_ip:px_axis_fdecfir32_1:1.0 ddc_stage2_fir
create_bd_cell -type ip -vlnv pentek.com:px_ip:px_axis_fdecfir32_1:1.0 ddc_stage3_fir
set_property -dict {CONFIG.out_res 24 CONFIG.bypass_in_lower false} [get_bd_cells ddc_stage3_fir]
create_bd_cell -type ip -vlnv xilinx.com:ip:axis_broadcaster:1.1 iq_broadcast
set_property -dict [list \
  CONFIG.NUM_MI 3 \
  CONFIG.M00_TDATA_REMAP {tdata[47:0]} \
  CONFIG.M01_TDATA_REMAP {tdata[47:0]} \
  CONFIG.M02_TDATA_REMAP {tdata[47:0]} \
  CONFIG.M00_TUSER_REMAP {tuser[127:0]} \
  CONFIG.M01_TUSER_REMAP {tuser[127:0]} \
  CONFIG.M02_TUSER_REMAP {tuser[127:0]} \
] [get_bd_cells iq_broadcast]
create_bd_cell -type ip -vlnv pentek.com:px_ip:px_axis_round:1.0 round_16i
set_property -dict {CONFIG.has_tuser true CONFIG.tuser_width 64} [get_bd_cells round_16i]
create_bd_cell -type ip -vlnv pentek.com:px_ip:px_axis_round:1.0 round_16q
set_property -dict {CONFIG.has_tuser true CONFIG.tuser_width 64} [get_bd_cells round_16q]
create_bd_cell -type ip -vlnv pentek.com:px_ip:px_axis_iq_fmtr_1:1.0 ddc_iq_fmtr
create_bd_cell -type ip -vlnv pentek.com:px_ip:px_axis_mixer_1:1.0 ddc_mixer
set_property -dict {CONFIG.sub_chan false CONFIG.chan 4} [get_bd_cells ddc_mixer]
create_bd_cell -type ip -vlnv pentek.com:px_ip:px_axis_nco_1:1.0 ddc_nco

# ---- hierarchy /dac0 ----
current_bd_instance /dac0
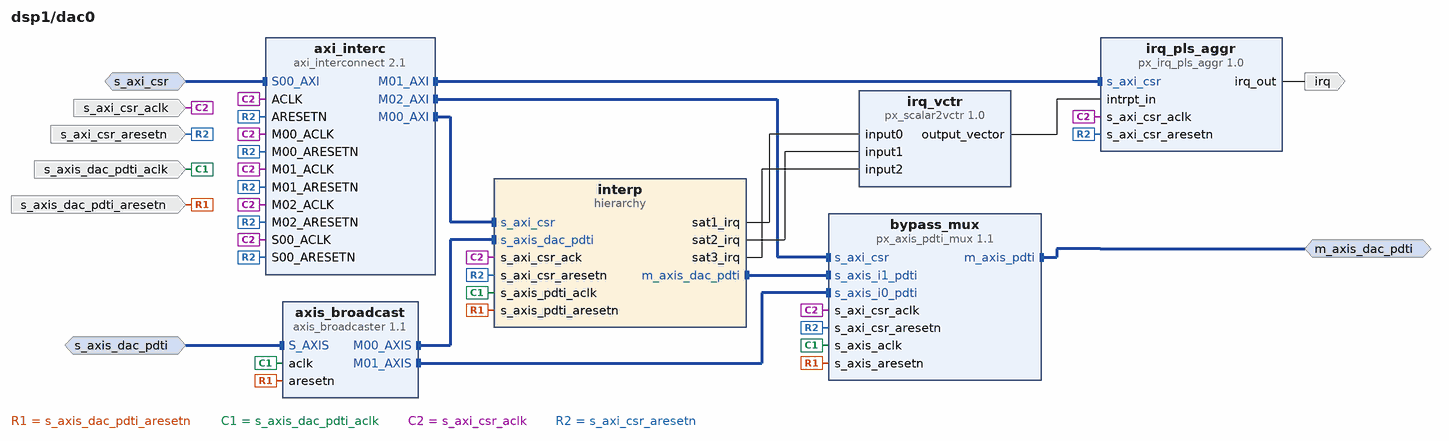
[diagram p10: block diagram inside /dac0]
create_bd_intf_pin -mode Slave -vlnv xilinx.com:interface:aximm_rtl:1.0 s_axi_csr
create_bd_intf_pin -mode Master -vlnv xilinx.com:interface:axis_rtl:1.0 m_axis_dac_pdti
create_bd_intf_pin -mode Slave -vlnv xilinx.com:interface:axis_rtl:1.0 s_axis_dac_pdti
create_bd_pin -dir I s_axis_dac_pdti_aresetn
create_bd_pin -dir I s_axis_dac_pdti_aclk
create_bd_pin -dir I s_axi_csr_aclk
create_bd_pin -dir I s_axi_csr_aresetn
create_bd_pin -dir O irq

create_bd_cell -type hier interp
create_bd_cell -type ip -vlnv xilinx.com:ip:axi_interconnect:2.1 axi_interc
set_property -dict [list \
  CONFIG.NUM_MI 3 \
  CONFIG.M00_HAS_REGSLICE 3 \
  CONFIG.M01_HAS_REGSLICE 3 \
  CONFIG.M02_HAS_REGSLICE 3 \
  CONFIG.M03_HAS_REGSLICE 3 \
  CONFIG.M04_HAS_REGSLICE 3 \
  CONFIG.S00_HAS_REGSLICE 1 \
] [get_bd_cells axi_interc]
create_bd_cell -type ip -vlnv xilinx.com:ip:axis_broadcaster:1.1 axis_broadcast
set_property -dict [list \
  CONFIG.NUM_MI 2 \
  CONFIG.HAS_TREADY 0 \
  CONFIG.M00_TDATA_REMAP {tdata[31:0]} \
  CONFIG.M01_TDATA_REMAP {tdata[31:0]} \
  CONFIG.M02_TDATA_REMAP {tdata[15:0]} \
  CONFIG.M00_TUSER_REMAP {tuser[127:0]} \
  CONFIG.M01_TUSER_REMAP {tuser[127:0]} \
  CONFIG.M02_TUSER_REMAP {tuser[127:0]} \
] [get_bd_cells axis_broadcast]
create_bd_cell -type ip -vlnv pentek.com:px_ip:px_axis_pdti_mux:1.1 bypass_mux
set_property -dict {CONFIG.data_byte_width 4 CONFIG.add_input_regs false} [get_bd_cells bypass_mux]
create_bd_cell -type ip -vlnv pentek.com:px_ip:px_irq_pls_aggr:1.0 irq_pls_aggr
set_property -dict {CONFIG.num_interrupt_sources 3} [get_bd_cells irq_pls_aggr]
create_bd_cell -type ip -vlnv pentek.com:px_ip:px_scalar2vctr:1.0 irq_vctr
set_property -dict {CONFIG.number_inputs 3} [get_bd_cells irq_vctr]

# ---- hierarchy /dac0/interp ----
current_bd_instance /dac0/interp
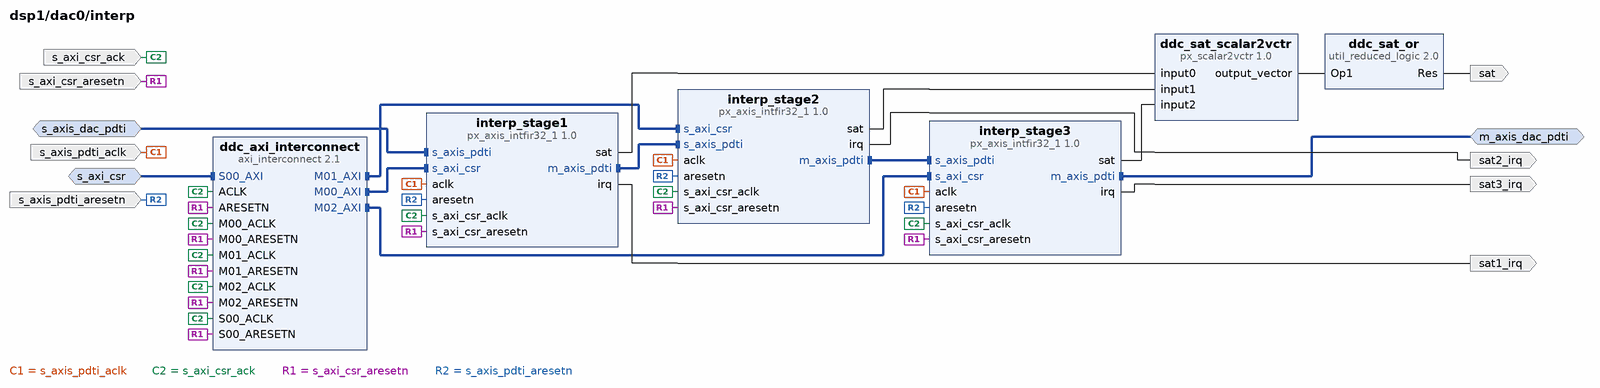
[diagram p11: block diagram inside /dac0/interp]
create_bd_intf_pin -mode Master -vlnv xilinx.com:interface:axis_rtl:1.0 m_axis_dac_pdti
create_bd_intf_pin -mode Slave -vlnv xilinx.com:interface:aximm_rtl:1.0 s_axi_csr
create_bd_intf_pin -mode Slave -vlnv xilinx.com:interface:axis_rtl:1.0 s_axis_dac_pdti
create_bd_pin -dir I s_axis_pdti_aclk
create_bd_pin -dir I s_axi_csr_ack
create_bd_pin -dir I s_axi_csr_aresetn
create_bd_pin -dir I s_axis_pdti_aresetn
create_bd_pin -dir O sat1_irq
create_bd_pin -dir O sat
create_bd_pin -dir O sat2_irq
create_bd_pin -dir O sat3_irq

create_bd_cell -type ip -vlnv xilinx.com:ip:util_reduced_logic:2.0 ddc_sat_or
set_property -dict {CONFIG.C_SIZE 3 CONFIG.C_OPERATION or} [get_bd_cells ddc_sat_or]
create_bd_cell -type ip -vlnv xilinx.com:ip:axi_interconnect:2.1 ddc_axi_interconnect
set_property -dict [list \
  CONFIG.NUM_MI 3 \
  CONFIG.M00_HAS_REGSLICE 3 \
  CONFIG.M01_HAS_REGSLICE 3 \
  CONFIG.M02_HAS_REGSLICE 3 \
  CONFIG.M03_HAS_REGSLICE 3 \
  CONFIG.M04_HAS_REGSLICE 3 \
  CONFIG.M05_HAS_REGSLICE 3 \
  CONFIG.S00_HAS_REGSLICE 1 \
] [get_bd_cells ddc_axi_interconnect]
create_bd_cell -type ip -vlnv pentek.com:px_ip:px_scalar2vctr:1.0 ddc_sat_scalar2vctr
set_property -dict {CONFIG.number_inputs 3} [get_bd_cells ddc_sat_scalar2vctr]
create_bd_cell -type ip -vlnv pentek.com:px_ip:px_axis_intfir32_1:1.0 interp_stage2
create_bd_cell -type ip -vlnv pentek.com:px_ip:px_axis_intfir32_1:1.0 interp_stage3
create_bd_cell -type ip -vlnv pentek.com:px_ip:px_axis_intfir32_1:1.0 interp_stage1

# ---- connections ----

current_bd_instance /adc_ch0
connect_bd_intf_net [get_bd_intf_pins axi_interc/M00_AXI] [get_bd_intf_pins ddc/s_axi_csr]
connect_bd_intf_net [get_bd_intf_pins axi_interc/M02_AXI] [get_bd_intf_pins thresh_gating/s_axi_csr]
connect_bd_intf_net [get_bd_intf_pins ddc/m_axis_pdti] [get_bd_intf_pins thresh_gating/s_axis_pdti]
connect_bd_intf_net [get_bd_intf_pins irq_pls_aggr/s_axi_csr] [get_bd_intf_pins axi_interc/M03_AXI]
connect_bd_intf_net [get_bd_intf_pins thresh_gating/s_axis_mag] [get_bd_intf_pins pwr_meter/m_axis_mag]
connect_bd_intf_net [get_bd_intf_pins axi_interc/M01_AXI] [get_bd_intf_pins pwr_meter/s_axi_csr]
connect_bd_intf_net [get_bd_intf_pins ddc/m_axis_16bit_pdti] [get_bd_intf_pins pwr_meter/s_axis_pdti]
connect_bd_intf_net [get_bd_intf_pins axis_broadcast/M00_AXIS] [get_bd_intf_pins ddc/s_axis_pdti]
connect_bd_intf_net [get_bd_intf_pins thresh_gating/m_axis_pdti] [get_bd_intf_pins bypass_mux/s_axis_i1_pdti]
connect_bd_intf_net [get_bd_intf_pins axis_broadcast/M01_AXIS] [get_bd_intf_pins axis_combine/S00_AXIS]
connect_bd_intf_net [get_bd_intf_pins axis_broadcast/M02_AXIS] [get_bd_intf_pins axis_combine/S01_AXIS]
connect_bd_intf_net [get_bd_intf_pins axis_combine/M_AXIS] [get_bd_intf_pins bypass_mux/s_axis_i0_pdti]
connect_bd_intf_net [get_bd_intf_pins axi_interc/M04_AXI] [get_bd_intf_pins bypass_mux/s_axi_csr]
connect_bd_intf_net [get_bd_intf_pins s_axi_csr] [get_bd_intf_pins axi_interc/S00_AXI]
connect_bd_intf_net [get_bd_intf_pins m_axis_pdti] [get_bd_intf_pins bypass_mux/m_axis_pdti]
connect_bd_intf_net [get_bd_intf_pins s_axis_pdti] [get_bd_intf_pins axis_broadcast/S_AXIS]
connect_bd_net [get_bd_pins s_axis_pdti_aresetn] \
  [get_bd_pins axis_broadcast/aresetn] [get_bd_pins axis_combine/aresetn] [get_bd_pins pwr_meter/axis_aresetn] \
  [get_bd_pins bypass_mux/s_axis_aresetn] [get_bd_pins ddc/s_axis_pdti_aresetn] \
  [get_bd_pins thresh_gating/s_axis_pdti_aresetn]
connect_bd_net [get_bd_pins s_axis_pdti_aclk] \
  [get_bd_pins axis_broadcast/aclk] [get_bd_pins axis_combine/aclk] [get_bd_pins pwr_meter/axis_aclk] \
  [get_bd_pins bypass_mux/s_axis_aclk] [get_bd_pins ddc/s_axis_pdti_aclk] [get_bd_pins thresh_gating/s_axis_pdti_aclk]
connect_bd_net -net s_axi_csr_ack_1 [get_bd_pins s_axi_csr_aclk] \
  [get_bd_pins irq_pls_aggr/s_axi_csr_aclk] [get_bd_pins pwr_meter/s_axi_csr_aclk] [get_bd_pins bypass_mux/s_axi_csr_aclk] \
  [get_bd_pins ddc/s_axi_csr_ack] [get_bd_pins thresh_gating/s_axi_csr_aclk] [get_bd_pins axi_interc/ACLK] \
  [get_bd_pins axi_interc/S00_ACLK] [get_bd_pins axi_interc/M00_ACLK] [get_bd_pins axi_interc/M01_ACLK] \
  [get_bd_pins axi_interc/M02_ACLK] [get_bd_pins axi_interc/M03_ACLK] [get_bd_pins axi_interc/M04_ACLK]
connect_bd_net [get_bd_pins s_axi_csr_aresetn] \
  [get_bd_pins irq_pls_aggr/s_axi_csr_aresetn] [get_bd_pins pwr_meter/s_axi_csr_aresetn] \
  [get_bd_pins bypass_mux/s_axi_csr_aresetn] [get_bd_pins ddc/s_axi_csr_aresetn] \
  [get_bd_pins thresh_gating/s_axi_csr_aresetn] [get_bd_pins axi_interc/ARESETN] [get_bd_pins axi_interc/S00_ARESETN] \
  [get_bd_pins axi_interc/M00_ARESETN] [get_bd_pins axi_interc/M01_ARESETN] [get_bd_pins axi_interc/M02_ARESETN] \
  [get_bd_pins axi_interc/M03_ARESETN] [get_bd_pins axi_interc/M04_ARESETN]
connect_bd_net -net px_scalar2vctr_0_output_vector [get_bd_pins irq_vctr/output_vector] [get_bd_pins irq_pls_aggr/intrpt_in]
connect_bd_net [get_bd_pins ddc/sat1_irq] [get_bd_pins irq_vctr/input0]
connect_bd_net [get_bd_pins ddc/sat2_irq] [get_bd_pins irq_vctr/input1]
connect_bd_net [get_bd_pins ddc/sat3_irq] [get_bd_pins irq_vctr/input2]
connect_bd_net [get_bd_pins thresh_gating/irq] [get_bd_pins irq_vctr/input4]
connect_bd_net -net px_irq_pls_aggr_0_irq_out [get_bd_pins irq_pls_aggr/irq_out] [get_bd_pins irq]
connect_bd_net [get_bd_pins pwr_meter/irq] [get_bd_pins irq_vctr/input3]

current_bd_instance /adc_ch0/ddc
connect_bd_intf_net [get_bd_intf_pins ddc_mixer/s_axis_nco] [get_bd_intf_pins ddc_nco/m_axis_pd]
connect_bd_intf_net [get_bd_intf_pins ddc_mixer/s_axis_pdti] [get_bd_intf_pins ddc_in_broadcast/M00_AXIS]
connect_bd_intf_net [get_bd_intf_pins ddc_axi_interc/M00_AXI] [get_bd_intf_pins ddc_mixer/s_axi_csr]
connect_bd_intf_net [get_bd_intf_pins ddc_axi_interc/M01_AXI] [get_bd_intf_pins ddc_nco/s_axi_csr]
connect_bd_intf_net [get_bd_intf_pins ddc_axi_interc/M05_AXI] [get_bd_intf_pins ddc_iq_fmtr/s_axi_csr]
connect_bd_intf_net [get_bd_intf_pins ddc_in_broadcast/M01_AXIS] [get_bd_intf_pins ddc_nco/s_axis_pdti]
connect_bd_intf_net [get_bd_intf_pins iq_broadcast/M00_AXIS] [get_bd_intf_pins axis_subset_i/S_AXIS]
connect_bd_intf_net [get_bd_intf_pins iq_broadcast/M01_AXIS] [get_bd_intf_pins axis_subset_q/S_AXIS]
connect_bd_intf_net [get_bd_intf_pins iq_broadcast/M02_AXIS] [get_bd_intf_pins ddc_iq_fmtr/s_axis_pdti]
connect_bd_intf_net [get_bd_intf_pins axis_subset_i/M_AXIS] [get_bd_intf_pins round_16i/s_axis]
connect_bd_intf_net [get_bd_intf_pins round_16q/s_axis] [get_bd_intf_pins axis_subset_q/M_AXIS]
connect_bd_intf_net [get_bd_intf_pins round_16i/m_axis] [get_bd_intf_pins axis_combiner/S00_AXIS]
connect_bd_intf_net [get_bd_intf_pins round_16q/m_axis] [get_bd_intf_pins axis_combiner/S01_AXIS]
connect_bd_intf_net [get_bd_intf_pins ddc_mixer/m_axis_pdti] [get_bd_intf_pins ddc_stage1_fir/s_axis_pdti]
connect_bd_intf_net [get_bd_intf_pins ddc_axi_interc/M02_AXI] [get_bd_intf_pins ddc_stage1_fir/s_axi_csr]
connect_bd_intf_net [get_bd_intf_pins ddc_stage1_fir/m_axis_pdti] [get_bd_intf_pins ddc_stage2_fir/s_axis_pdti]
connect_bd_intf_net [get_bd_intf_pins ddc_stage2_fir/s_axi_csr] [get_bd_intf_pins ddc_axi_interc/M03_AXI]
connect_bd_intf_net [get_bd_intf_pins ddc_stage2_fir/m_axis_pdti] [get_bd_intf_pins ddc_stage3_fir/s_axis_pdti]
connect_bd_intf_net [get_bd_intf_pins ddc_stage3_fir/s_axi_csr] [get_bd_intf_pins ddc_axi_interc/M04_AXI]
connect_bd_intf_net [get_bd_intf_pins ddc_stage3_fir/m_axis_pdti] [get_bd_intf_pins iq_broadcast/S_AXIS]
connect_bd_intf_net [get_bd_intf_pins s_axis_pdti] [get_bd_intf_pins ddc_in_broadcast/S_AXIS]
connect_bd_intf_net [get_bd_intf_pins m_axis_pdti] [get_bd_intf_pins ddc_iq_fmtr/m_axis_pdti]
connect_bd_intf_net [get_bd_intf_pins s_axi_csr] [get_bd_intf_pins ddc_axi_interc/S00_AXI]
connect_bd_intf_net [get_bd_intf_pins m_axis_16bit_pdti] [get_bd_intf_pins axis_combiner/M_AXIS]
connect_bd_net [get_bd_pins s_axis_pdti_aclk] \
  [get_bd_pins axis_combiner/aclk] [get_bd_pins axis_subset_i/aclk] [get_bd_pins axis_subset_q/aclk] \
  [get_bd_pins ddc_in_broadcast/aclk] [get_bd_pins ddc_stage2_fir/aclk] [get_bd_pins ddc_stage3_fir/aclk] \
  [get_bd_pins iq_broadcast/aclk] [get_bd_pins ddc_stage1_fir/aclk] [get_bd_pins round_16i/axis_aclk] \
  [get_bd_pins round_16q/axis_aclk] [get_bd_pins ddc_iq_fmtr/aclk] [get_bd_pins ddc_mixer/aclk] [get_bd_pins ddc_nco/aclk]
connect_bd_net [get_bd_pins s_axi_csr_ack] \
  [get_bd_pins ddc_stage2_fir/s_axi_csr_aclk] [get_bd_pins ddc_stage3_fir/s_axi_csr_aclk] \
  [get_bd_pins ddc_stage1_fir/s_axi_csr_aclk] [get_bd_pins ddc_iq_fmtr/s_axi_csr_aclk] [get_bd_pins ddc_mixer/s_axi_csr_aclk] \
  [get_bd_pins ddc_nco/s_axi_csr_aclk] [get_bd_pins ddc_axi_interc/ACLK] [get_bd_pins ddc_axi_interc/S00_ACLK] \
  [get_bd_pins ddc_axi_interc/M00_ACLK] [get_bd_pins ddc_axi_interc/M01_ACLK] [get_bd_pins ddc_axi_interc/M02_ACLK] \
  [get_bd_pins ddc_axi_interc/M03_ACLK] [get_bd_pins ddc_axi_interc/M04_ACLK] [get_bd_pins ddc_axi_interc/M05_ACLK]
connect_bd_net [get_bd_pins s_axi_csr_aresetn] \
  [get_bd_pins ddc_stage2_fir/s_axi_csr_aresetn] [get_bd_pins ddc_stage3_fir/s_axi_csr_aresetn] \
  [get_bd_pins ddc_stage1_fir/s_axi_csr_aresetn] [get_bd_pins ddc_iq_fmtr/s_axi_csr_aresetn] \
  [get_bd_pins ddc_mixer/s_axi_csr_aresetn] [get_bd_pins ddc_nco/s_axi_csr_aresetn] [get_bd_pins ddc_axi_interc/ARESETN] \
  [get_bd_pins ddc_axi_interc/S00_ARESETN] [get_bd_pins ddc_axi_interc/M00_ARESETN] [get_bd_pins ddc_axi_interc/M01_ARESETN] \
  [get_bd_pins ddc_axi_interc/M02_ARESETN] [get_bd_pins ddc_axi_interc/M03_ARESETN] [get_bd_pins ddc_axi_interc/M04_ARESETN] \
  [get_bd_pins ddc_axi_interc/M05_ARESETN]
connect_bd_net [get_bd_pins s_axis_pdti_aresetn] \
  [get_bd_pins axis_combiner/aresetn] [get_bd_pins axis_subset_i/aresetn] [get_bd_pins axis_subset_q/aresetn] \
  [get_bd_pins ddc_in_broadcast/aresetn] [get_bd_pins ddc_stage2_fir/aresetn] [get_bd_pins ddc_stage3_fir/aresetn] \
  [get_bd_pins iq_broadcast/aresetn] [get_bd_pins ddc_stage1_fir/aresetn] [get_bd_pins round_16i/axis_aresetn] \
  [get_bd_pins round_16q/axis_aresetn] [get_bd_pins ddc_iq_fmtr/aresetn] [get_bd_pins ddc_mixer/aresetn] \
  [get_bd_pins ddc_nco/aresetn]
connect_bd_net -net px_scalar2vctr_0_output_vector1 [get_bd_pins ddc_sat_sc2vctr/output_vector] [get_bd_pins ddc_sat_or/Op1]
connect_bd_net -net ch0_sat_or_Res [get_bd_pins ddc_sat_or/Res] [get_bd_pins sat]
connect_bd_net [get_bd_pins ddc_stage3_fir/irq] [get_bd_pins sat3_irq]
connect_bd_net [get_bd_pins ddc_stage2_fir/irq] [get_bd_pins sat2_irq]
connect_bd_net [get_bd_pins ddc_stage1_fir/irq] [get_bd_pins sat1_irq]
connect_bd_net [get_bd_pins ddc_stage3_fir/sat] [get_bd_pins ddc_sat_sc2vctr/input2]
connect_bd_net [get_bd_pins ddc_stage2_fir/sat] [get_bd_pins ddc_sat_sc2vctr/input1]
connect_bd_net [get_bd_pins ddc_stage1_fir/sat] [get_bd_pins ddc_sat_sc2vctr/input0]

current_bd_instance /adc_ch0/thresh_gating
connect_bd_intf_net [get_bd_intf_pins thresh_det/m_axis_detect] [get_bd_intf_pins detect_axis_decompose/s_axis]
connect_bd_intf_net [get_bd_intf_pins thresh_axi_interconnect/M01_AXI] [get_bd_intf_pins thresh_det/s_axi_csr]
connect_bd_intf_net [get_bd_intf_pins thresh_axi_interconnect/M00_AXI] [get_bd_intf_pins threshold_gate_cntl/s_axi_csr]
connect_bd_intf_net [get_bd_intf_pins s_axi_csr] [get_bd_intf_pins thresh_axi_interconnect/S00_AXI]
connect_bd_intf_net [get_bd_intf_pins s_axis_mag] [get_bd_intf_pins thresh_det/s_axis]
connect_bd_intf_net [get_bd_intf_pins s_axis_pdti] [get_bd_intf_pins threshold_gate_cntl/s_axis_pdti]
connect_bd_intf_net [get_bd_intf_pins m_axis_pdti] [get_bd_intf_pins threshold_gate_cntl/m_axis_pdti]
connect_bd_net [get_bd_pins s_axi_csr_aclk] \
  [get_bd_pins threshold_gate_cntl/s_axi_csr_aclk] [get_bd_pins thresh_det/s_axi_csr_aclk] \
  [get_bd_pins thresh_axi_interconnect/ACLK] [get_bd_pins thresh_axi_interconnect/S00_ACLK] \
  [get_bd_pins thresh_axi_interconnect/M00_ACLK] [get_bd_pins thresh_axi_interconnect/M01_ACLK]
connect_bd_net [get_bd_pins s_axi_csr_aresetn] \
  [get_bd_pins threshold_gate_cntl/s_axi_csr_aresetn] [get_bd_pins thresh_det/s_axi_csr_aresetn] \
  [get_bd_pins thresh_axi_interconnect/ARESETN] [get_bd_pins thresh_axi_interconnect/S00_ARESETN] \
  [get_bd_pins thresh_axi_interconnect/M00_ARESETN] [get_bd_pins thresh_axi_interconnect/M01_ARESETN]
connect_bd_net -net axis_aclk_1 [get_bd_pins s_axis_pdti_aclk] \
  [get_bd_pins detect_axis_decompose/aclk] [get_bd_pins threshold_gate_cntl/axis_aclk] [get_bd_pins thresh_det/axis_aclk]
connect_bd_net -net axis_aresetn_1 [get_bd_pins s_axis_pdti_aresetn] \
  [get_bd_pins detect_axis_decompose/aresetn] [get_bd_pins threshold_gate_cntl/axis_aresetn] \
  [get_bd_pins thresh_det/axis_aresetn]
connect_bd_net [get_bd_pins thresh_det/irq] [get_bd_pins irq]
connect_bd_net [get_bd_pins detect_axis_decompose/m_axis_tdata] [get_bd_pins detect_vctr_subset/in_vector]
connect_bd_net [get_bd_pins detect_vctr_subset/out_vector] [get_bd_pins threshold_gate_cntl/gate_in]
